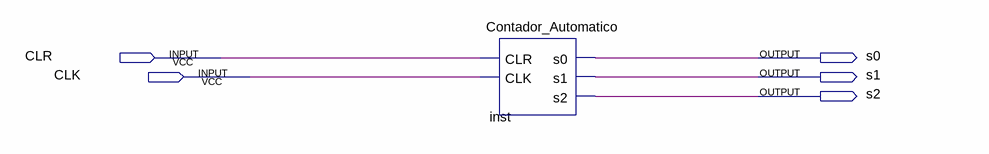
[diagram p0: schematic sheet]
// Quartus schematic teste.bdf as structural Verilog: 1 symbols, 5 pins
module teste (
  input  CLR,
  input  CLK,
  output s0,
  output s1,
  output s2
);

  Contador_Automatico inst (.CLR(CLR), .CLK(CLK), .s0(s0), .s1(s1), .s2(s2));
endmodule
